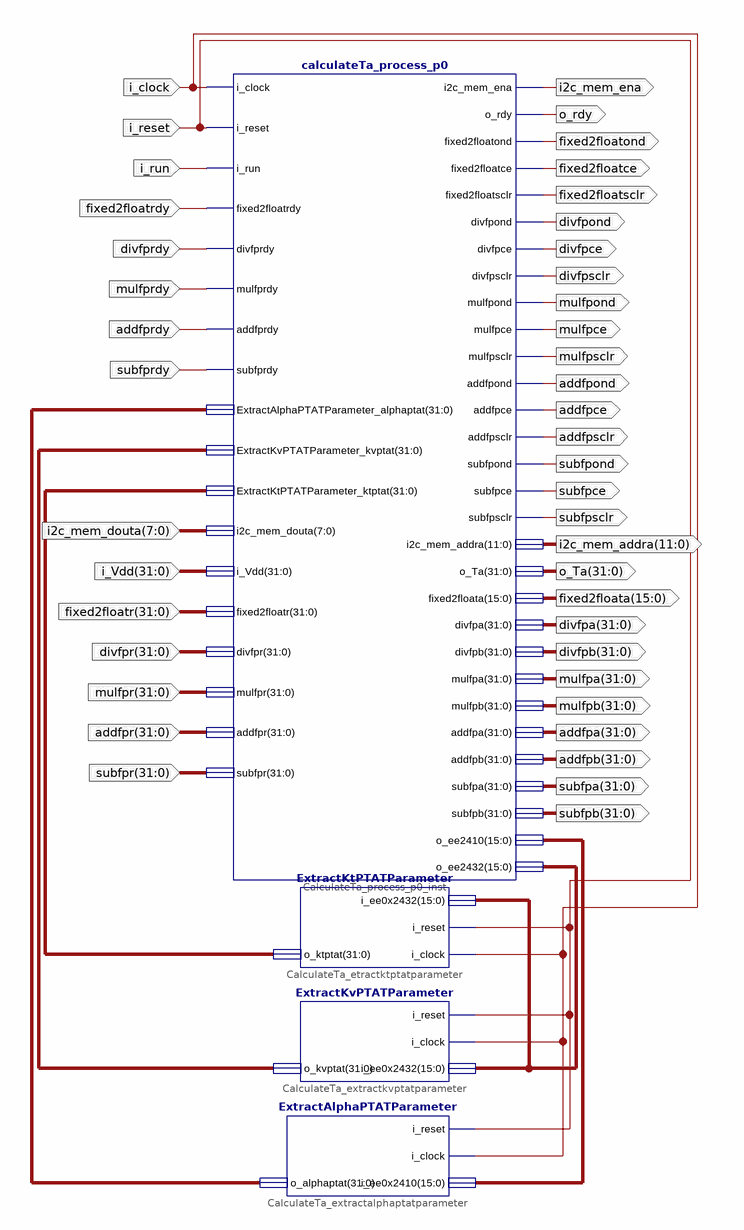
[diagram p0: schematic sheet 1]
// Xilinx ISE schematic CalculateTa.sch (virtex4) as structural Verilog: 4 symbols, 43 ports
module CalculateTa (
  input  i_clock,
  input  i_reset,
  input  i_run,
  input  fixed2floatrdy,
  input  divfprdy,
  input  mulfprdy,
  input  addfprdy,
  input  subfprdy,
  input  [7:0] i2c_mem_douta,
  input  [31:0] i_Vdd,
  input  [31:0] fixed2floatr,
  input  [31:0] divfpr,
  input  [31:0] mulfpr,
  input  [31:0] addfpr,
  input  [31:0] subfpr,
  output i2c_mem_ena,
  output o_rdy,
  output fixed2floatond,
  output fixed2floatce,
  output fixed2floatsclr,
  output divfpond,
  output divfpce,
  output divfpsclr,
  output mulfpond,
  output mulfpce,
  output mulfpsclr,
  output addfpond,
  output addfpce,
  output addfpsclr,
  output subfpond,
  output subfpce,
  output subfpsclr,
  output [11:0] i2c_mem_addra,
  output [31:0] o_Ta,
  output [15:0] fixed2floata,
  output [31:0] divfpa,
  output [31:0] divfpb,
  output [31:0] mulfpa,
  output [31:0] mulfpb,
  output [31:0] addfpa,
  output [31:0] addfpb,
  output [31:0] subfpa,
  output [31:0] subfpb
);

  wire [15:0] ee0x2410, ee0x2432;
  wire [31:0] XLXN_4, XLXN_5, XLXN_6;

  calculateTa_process_p0 CalculateTa_process_p0_inst (
    .i_clock(i_clock), .i_reset(i_reset), .i_run(i_run), .fixed2floatrdy(fixed2floatrdy),
    .divfprdy(divfprdy), .mulfprdy(mulfprdy), .addfprdy(addfprdy), .subfprdy(subfprdy),
    .ExtractAlphaPTATParameter_alphaptat(XLXN_6), .ExtractKvPTATParameter_kvptat(XLXN_5),
    .ExtractKtPTATParameter_ktptat(XLXN_4), .i2c_mem_douta(i2c_mem_douta), .i_Vdd(i_Vdd),
    .fixed2floatr(fixed2floatr), .divfpr(divfpr), .mulfpr(mulfpr), .addfpr(addfpr), .subfpr(subfpr),
    .i2c_mem_ena(i2c_mem_ena), .o_rdy(o_rdy), .fixed2floatond(fixed2floatond), .fixed2floatce(fixed2floatce),
    .fixed2floatsclr(fixed2floatsclr), .divfpond(divfpond), .divfpce(divfpce), .divfpsclr(divfpsclr),
    .mulfpond(mulfpond), .mulfpce(mulfpce), .mulfpsclr(mulfpsclr), .addfpond(addfpond), .addfpce(addfpce),
    .addfpsclr(addfpsclr), .subfpond(subfpond), .subfpce(subfpce), .subfpsclr(subfpsclr),
    .o_ee2410(ee0x2410), .o_ee2432(ee0x2432), .i2c_mem_addra(i2c_mem_addra), .o_Ta(o_Ta),
    .fixed2floata(fixed2floata), .divfpa(divfpa), .divfpb(divfpb), .mulfpa(mulfpa), .mulfpb(mulfpb),
    .addfpa(addfpa), .addfpb(addfpb), .subfpa(subfpa), .subfpb(subfpb));
  ExtractKtPTATParameter CalculateTa_etractktptatparameter (
    .i_clock(i_clock), .i_reset(i_reset), .i_ee0x2432(ee0x2432), .o_ktptat(XLXN_4));
  ExtractKvPTATParameter CalculateTa_extractkvptatparameter (
    .i_ee0x2432(ee0x2432), .i_clock(i_clock), .i_reset(i_reset), .o_kvptat(XLXN_5));
  ExtractAlphaPTATParameter CalculateTa_extractalphaptatparameter (
    .i_ee0x2410(ee0x2410), .i_clock(i_clock), .i_reset(i_reset), .o_alphaptat(XLXN_6));
endmodule
